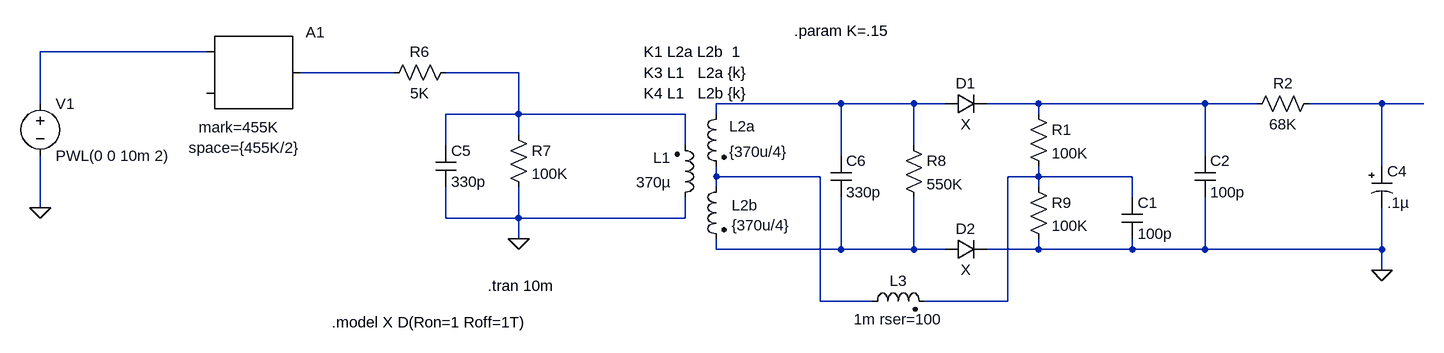
[diagram p0: schematic discrim.asc]
discrim.asc, the LTspice schematic file:
Version 4
SHEET 1 3108 1440
WIRE 1232 1008 976 1008
WIRE 1520 1040 1376 1040
WIRE 1712 1040 1600 1040
WIRE 976 1088 976 1008
WIRE 2208 1088 2016 1088
WIRE 2320 1088 2208 1088
WIRE 2368 1088 2320 1088
WIRE 2512 1088 2432 1088
WIRE 2768 1088 2512 1088
WIRE 2848 1088 2768 1088
WIRE 3040 1088 2928 1088
WIRE 3104 1088 3040 1088
WIRE 1712 1104 1712 1040
WIRE 1712 1104 1600 1104
WIRE 1968 1104 1712 1104
WIRE 2016 1104 2016 1088
WIRE 2512 1104 2512 1088
WIRE 1712 1136 1712 1104
WIRE 1600 1152 1600 1104
WIRE 1968 1152 1968 1104
WIRE 2320 1152 2320 1088
WIRE 2208 1168 2208 1088
WIRE 2768 1168 2768 1088
WIRE 3040 1184 3040 1088
WIRE 2016 1200 2016 1184
WIRE 2176 1200 2016 1200
WIRE 2512 1200 2512 1184
WIRE 2512 1200 2464 1200
WIRE 2656 1200 2512 1200
WIRE 2016 1216 2016 1200
WIRE 2512 1216 2512 1200
WIRE 2656 1232 2656 1200
WIRE 976 1248 976 1168
WIRE 1600 1264 1600 1216
WIRE 1712 1264 1712 1216
WIRE 1712 1264 1600 1264
WIRE 1968 1264 1968 1232
WIRE 1968 1264 1712 1264
WIRE 1712 1296 1712 1264
WIRE 2016 1312 2016 1296
WIRE 2208 1312 2208 1232
WIRE 2208 1312 2016 1312
WIRE 2320 1312 2320 1232
WIRE 2320 1312 2208 1312
WIRE 2368 1312 2320 1312
WIRE 2512 1312 2512 1296
WIRE 2512 1312 2432 1312
WIRE 2656 1312 2656 1296
WIRE 2656 1312 2512 1312
WIRE 2768 1312 2768 1232
WIRE 2768 1312 2656 1312
WIRE 3040 1312 3040 1248
WIRE 3040 1312 2768 1312
WIRE 3040 1344 3040 1312
WIRE 2176 1392 2176 1200
WIRE 2256 1392 2176 1392
WIRE 2464 1392 2464 1200
WIRE 2464 1392 2336 1392
FLAG 1712 1296 0
FLAG 976 1248 0
FLAG 3040 1344 0
SYMBOL ind2 1952 1248 M180
WINDOW 0 -6 77 Right 2
WINDOW 3 -5 39 Right 2
SYMATTR InstName L1
SYMATTR Value 370µ
SYMBOL ind2 2032 1088 M0
WINDOW 0 -4 35 Right 2
WINDOW 3 -4 74 Right 2
SYMATTR InstName L2a
SYMATTR Value {370u/4}
SYMBOL ind2 2032 1200 M0
WINDOW 0 -8 44 Right 2
WINDOW 3 -8 75 Right 2
SYMATTR InstName L2b
SYMATTR Value {370u/4}
SYMBOL diode 2368 1104 R270
WINDOW 0 32 32 VTop 2
WINDOW 3 0 32 VBottom 2
SYMATTR InstName D1
SYMATTR Value X
SYMBOL diode 2368 1328 R270
WINDOW 0 32 32 VTop 2
WINDOW 3 0 32 VBottom 2
SYMATTR InstName D2
SYMATTR Value X
SYMBOL RES 2944 1072 R90
WINDOW 0 0 56 VBottom 2
WINDOW 3 32 56 VTop 2
SYMATTR InstName R2
SYMATTR Value 68K
SYMBOL polcap 3024 1184 R0
SYMATTR InstName C4
SYMATTR Value .1µ
SYMBOL cap 1584 1152 R0
SYMATTR InstName C5
SYMATTR Value 330p
SYMBOL VOLTAGE 976 1072 R0
SYMATTR InstName V1
SYMATTR Value PWL(0 0 10m 2)
SYMBOL res 1616 1024 R90
WINDOW 0 0 56 VBottom 2
WINDOW 3 32 56 VTop 2
SYMATTR InstName R6
SYMATTR Value 5K
SYMBOL res 1696 1120 R0
SYMATTR InstName R7
SYMATTR Value 100K
SYMBOL cap 2192 1168 R0
SYMATTR InstName C6
SYMATTR Value 330p
SYMBOL res 2304 1136 R0
SYMATTR InstName R8
SYMATTR Value 550K
SYMBOL SPECIALFUNCTIONS\\MODULATE 1232 1008 R0
WINDOW 3 -12 116 Left 2
WINDOW 123 -28 148 Left 2
SYMATTR Value mark=455K
SYMATTR Value2 space={455K/2}
SYMATTR InstName A1
SYMBOL res 2496 1088 R0
SYMATTR InstName R1
SYMATTR Value 100K
SYMBOL res 2496 1200 R0
SYMATTR InstName R9
SYMATTR Value 100K
SYMBOL cap 2640 1232 R0
SYMATTR InstName C1
SYMATTR Value 100p
SYMBOL cap 2752 1168 R0
SYMATTR InstName C2
SYMATTR Value 100p
SYMBOL ind2 2240 1408 R270
WINDOW 0 32 56 VTop 2
WINDOW 3 4 56 VBottom 2
SYMATTR InstName L3
SYMATTR Value 1m rser=100
TEXT 1424 1424 Left 2 !.model X D(Ron=1 Roff=1T)
TEXT 1664 1368 Left 2 !.tran 10m
TEXT 1904 1008 Left 2 !K1 L2a L2b  1
TEXT 1904 1040 Left 2 !K3 L1   L2a {k}
TEXT 1904 1072 Left 2 !K4 L1   L2b {k}
TEXT 2136 976 Left 2 !.param K=.15

The netlist it stands for:
* discrim.asc
L1 0 N003 370µ
L2a N004 N007 {370u/4}
L2b N007 N009 {370u/4}
D1 N004 N005 X
D2 N009 0 X
R2 N006 N005 68K
C4 N006 0 .1µ
C5 N003 0 330p
V1 N001 0 PWL(0 0 10m 2)
R6 N003 N002 5K
R7 N003 0 100K
C6 N004 N009 330p
R8 N004 N009 550K
A1 N001 0 0 0 0 0 N002 0 MODULATOR mark=455K space={455K/2}
R1 N005 N008 100K
R9 N008 0 100K
C1 N008 0 100p
C2 N005 0 100p
L3 N007 N008 1m rser=100
.model D D
.lib standard.dio
.model X D(Ron=1 Roff=1T)
.tran 10m
K1 L2a L2b  1
K3 L1   L2a {k}
K4 L1   L2b {k}
.param K=.15
.backanno
.end